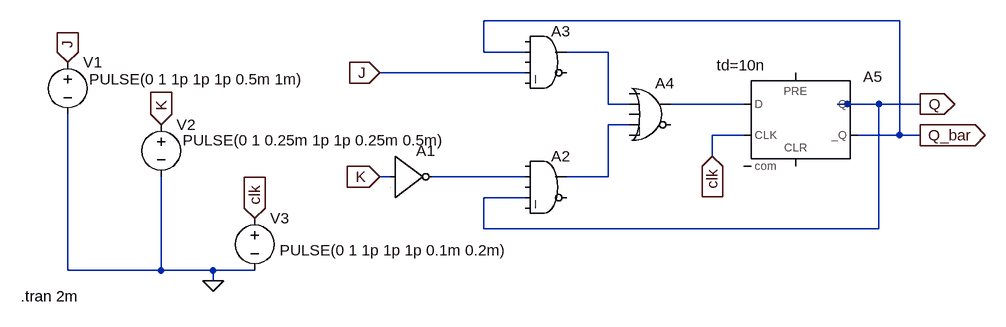
[diagram p0: schematic JK_flipflop_using_D_flipflop.asc]
JK_flipflop_using_D_flipflop.asc, the LTspice schematic file:
Version 4
SHEET 1 1092 680
WIRE 928 -48 288 -48
WIRE 288 0 288 -48
WIRE 352 0 288 0
WIRE 480 0 416 0
WIRE 352 32 128 32
WIRE 480 80 480 0
WIRE 512 80 480 80
WIRE 688 80 576 80
WIRE 848 80 832 80
WIRE 896 80 848 80
WIRE 960 80 896 80
WIRE 512 112 480 112
WIRE 688 128 640 128
WIRE 928 128 928 -48
WIRE 928 128 864 128
WIRE 960 128 928 128
WIRE 640 160 640 128
WIRE 144 192 128 192
WIRE 352 192 208 192
WIRE 480 192 480 112
WIRE 480 192 416 192
WIRE 352 224 288 224
WIRE 288 272 288 224
WIRE 896 272 896 80
WIRE 896 272 288 272
WIRE -352 336 -352 96
WIRE -208 336 -208 192
WIRE -208 336 -352 336
WIRE -128 336 -208 336
WIRE -64 336 -128 336
WIRE -128 352 -128 336
FLAG 128 32 J
IOPIN 128 32 In
FLAG 128 192 K
IOPIN 128 192 In
FLAG 640 160 clk
IOPIN 640 160 In
FLAG 960 80 Q
IOPIN 960 80 Out
FLAG 960 128 Q_bar
IOPIN 960 128 Out
FLAG -128 352 0
FLAG -352 16 J
IOPIN -352 16 In
FLAG -208 112 K
IOPIN -208 112 In
FLAG -64 256 clk
IOPIN -64 256 In
SYMBOL Digital\\inv 144 128 R0
SYMATTR InstName A1
SYMBOL Digital\\and 384 144 R0
SYMATTR InstName A2
SYMBOL Digital\\and 384 -48 R0
SYMATTR InstName A3
SYMBOL Digital\\or 544 32 R0
SYMATTR InstName A4
SYMBOL Digital\\dflop 768 32 R0
WINDOW 3 -121 -12 Left 2
SYMATTR Value td=10n
SYMATTR InstName A5
SYMBOL voltage -352 0 R0
WINDOW 3 33 42 Left 2
WINDOW 123 0 0 Left 0
WINDOW 39 0 0 Left 0
SYMATTR Value PULSE(0 1 1p 1p 1p 0.5m 1m)
SYMATTR InstName V1
SYMBOL voltage -208 96 R0
WINDOW 3 33 40 Left 2
WINDOW 123 0 0 Left 0
WINDOW 39 0 0 Left 0
SYMATTR Value PULSE(0 1 0.25m 1p 1p 0.25m 0.5m)
SYMATTR InstName V2
SYMBOL voltage -64 240 R0
WINDOW 3 38 65 Left 2
WINDOW 123 0 0 Left 0
WINDOW 39 0 0 Left 0
SYMATTR Value PULSE(0 1 1p 1p 1p 0.1m 0.2m)
SYMATTR InstName V3
TEXT -424 376 Left 2 !.tran 2m

The netlist it stands for:
* JK_flipflop_using_D_flipflop.asc
A1 K 0 0 0 0 N004 0 0 BUF
A2 0 N004 0 Q 0 0 N003 0 AND
A3 0 Q_bar 0 J 0 0 N001 0 AND
A4 0 N001 0 N003 0 0 N002 0 OR
A5 N002 0 clk 0 0 Q_bar Q 0 DFLOP td=10n
V1 J 0 PULSE(0 1 1p 1p 1p 0.5m 1m)
V2 K 0 PULSE(0 1 0.25m 1p 1p 0.25m 0.5m)
V3 clk 0 PULSE(0 1 1p 1p 1p 0.1m 0.2m)
.tran 2m
.backanno
.end